# Altium schematic sheet RS485.SchDoc
size A4
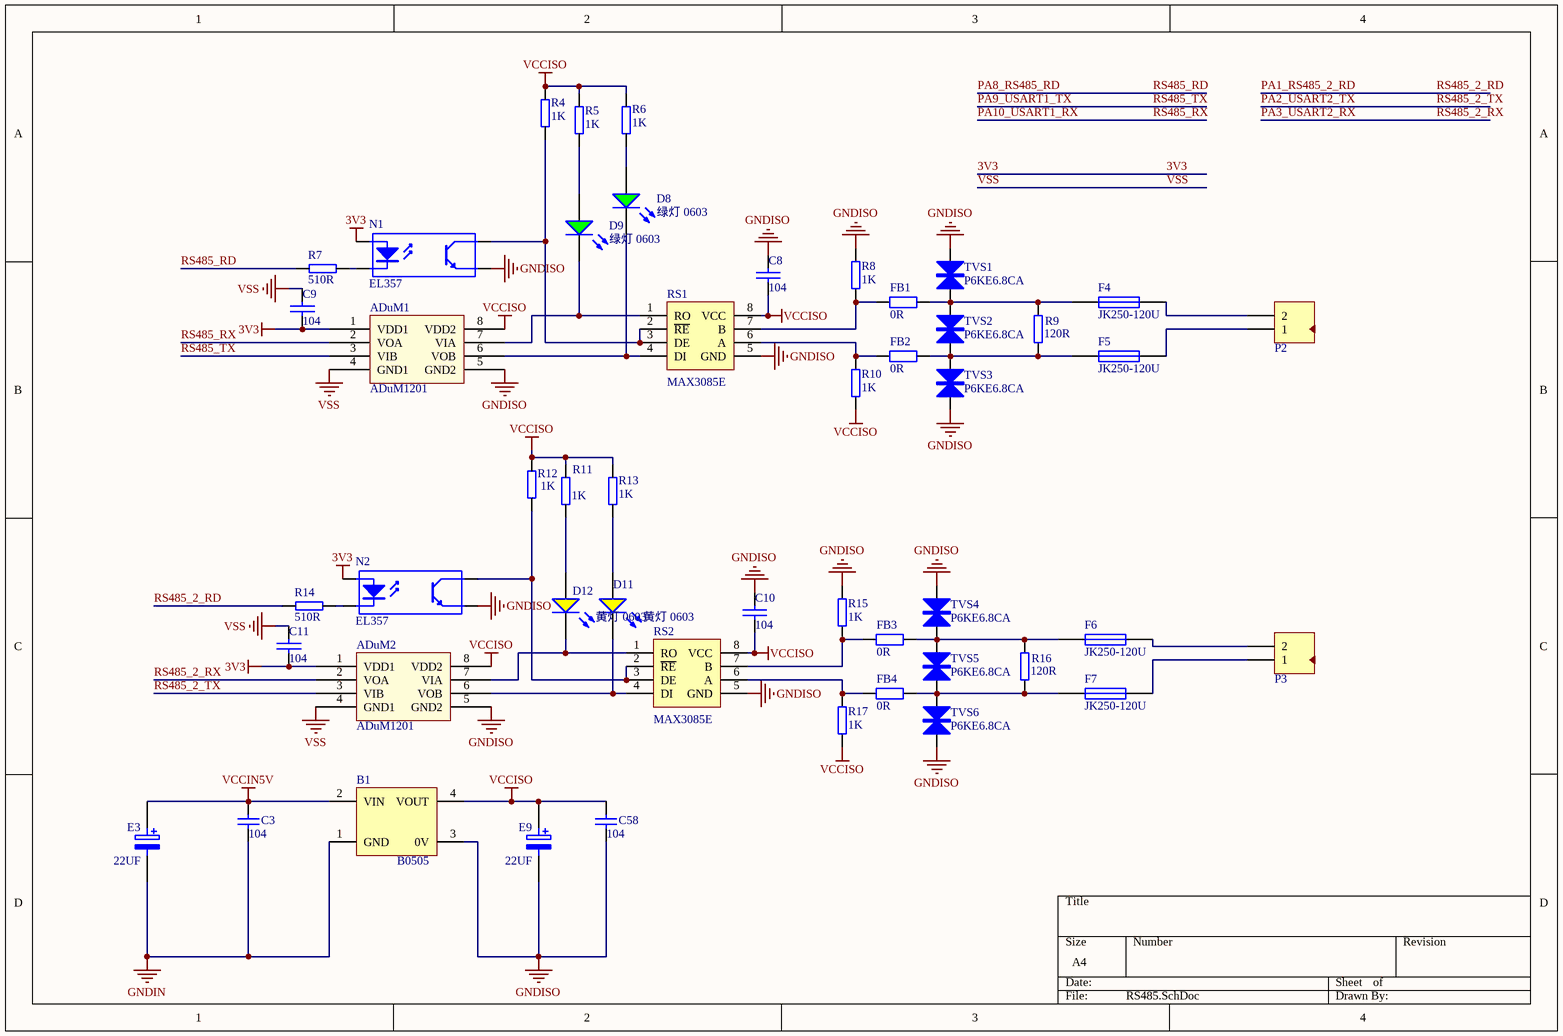
[diagram p0: RS485.SchDoc]

## Parts
ADuM1  ADuM1201  [SOIC-8]
ADuM2  ADuM1201  [SOIC-8]
B1  B0505  [B0505D-1WR2]
C3  104  [LC-0603_C]
C8  104  [LC-0603_C]
C9  104  [LC-0603_C]
C10  104  [LC-0603_C]
C11  104  [LC-0603_C]
C58  104  [LC-0603_C]
D8  绿灯 0603  [LC-0603_LED_S1]
D9  绿灯 0603  [LC-0603_LED_S1]
D11  黄灯 0603  [LC-0603_LED_S1]
D12  黄灯 0603  [LC-0603_LED_S1]
E3  22UF  [LC-CASE-B_3528]
E9  22UF  [LC-CASE-B_3528]
F4  JK250-120U  [ntc250v]
F5  JK250-120U  [ntc250v]
F6  JK250-120U  [ntc250v]
F7  JK250-120U  [ntc250v]
FB1  0R  [LC-0603_L]
FB2  0R  [LC-0603_L]
FB3  0R  [LC-0603_L]
FB4  0R  [LC-0603_L]
N1  EL357  [lc-sop-4_P2.54]
N2  EL357  [lc-sop-4_P2.54]
P2  Header 2  [D5.08-2P]  (value not drawn)
P3  Header 2  [D5.08-2P]  (value not drawn)
R4  1K  [LC-0603_R]
R5  1K  [LC-0603_R]
R6  1K  [LC-0603_R]
R7  510R  [LC-0603_R]
R8  1K  [LC-0603_R]
R9  120R  [LC-0603_R]
R10  1K  [LC-0603_R]
R11  1K  [LC-0603_R]
R12  1K  [LC-0603_R]
R13  1K  [LC-0603_R]
R14  510R  [LC-0603_R]
R15  1K  [LC-0603_R]
R16  120R  [LC-0603_R]
R17  1K  [LC-0603_R]
RS1  MAX3085E  [SOIC-8]
RS2  MAX3085E  [SOIC-8]
TVS1  P6KE6.8CA  [TVS]
TVS2  P6KE6.8CA  [TVS]
TVS3  P6KE6.8CA  [TVS]
TVS4  P6KE6.8CA  [TVS]
TVS5  P6KE6.8CA  [TVS]
TVS6  P6KE6.8CA  [TVS]

## Nets
3V3: ADuM1.1(VDD1) ADuM2.1(VDD1) C9.2 C11.2 N1.1(A) N2.1(A)
GNDIN: B1.1(GND) C3.2 E3.2
GNDISO: ADuM1.5(GND2) ADuM2.5(GND2) B1.3(0V) C8.1 C10.1 C58.2 E9.2 N1.3(E) N2.3(E) R8.1 R15.1 RS1.5(GND) RS2.5(GND) TVS1.2 TVS3.1 TVS4.2 TVS6.1
VCCIN5V: B1.2(VIN) C3.1 E3.1
VCCISO: ADuM1.8(VDD2) ADuM2.8(VDD2) B1.4(VOUT) C8.2 C10.2 C58.1 E9.1 R4.1 R5.2 R6.1 R10.2 R11.2 R12.1 R13.1 R17.2 RS1.8(VCC) RS2.8(VCC)
VSS: ADuM1.4(GND1) ADuM2.4(GND1) C9.1 C11.1
PA1_RS485_2_RD: R14.1  [also labelled RS485_2_RD]
PA2_USART2_TX: ADuM2.3(VIB)  [also labelled RS485_2_TX]
PA3_USART2_RX: ADuM2.2(VOA)  [also labelled RS485_2_RX]
PA8_RS485_RD: R7.1  [also labelled RS485_RD]
PA9_USART1_TX: ADuM1.3(VIB)  [also labelled RS485_TX]
PA10_USART1_RX: ADuM1.2(VOA)  [also labelled RS485_RX]
NetADuM1_6: ADuM1.6(VOB) D8.K RS1.4(DI)
NetADuM1_7: ADuM1.7(VIA) D9.K RS1.1(RO)
NetADuM2_6: ADuM2.6(VOB) D11.K RS2.4(DI)
NetADuM2_7: ADuM2.7(VIA) D12.K RS2.1(RO)
NetD8_A: D8.A R6.2
NetD9_A: D9.A R5.1
NetD11_A: D11.A R13.2
NetD12_A: D12.A R11.1
NetF4_1: F4.1 FB1.1 R9.2 TVS1.1 TVS2.2
NetF4_2: F4.2 P2.2
NetF5_1: F5.1 FB2.1 R9.1 TVS2.1 TVS3.2
NetF5_2: F5.2 P2.1
NetF6_1: F6.1 FB3.1 R16.2 TVS4.1 TVS5.2
NetF6_2: F6.2 P3.2
NetF7_1: F7.1 FB4.1 R16.1 TVS5.1 TVS6.2
NetF7_2: F7.2 P3.1
NetFB1_2: FB1.2 R8.2 RS1.7(B)
NetFB2_2: FB2.2 R10.1 RS1.6(A)
NetFB3_2: FB3.2 R15.2 RS2.7(B)
NetFB4_2: FB4.2 R17.1 RS2.6(A)
NetN1_2: N1.2(K) R7.2
NetN1_4: N1.4(C) R4.2 RS1.2(~{RE}) RS1.3(DE)
NetN2_2: N2.2(K) R14.2
NetN2_4: N2.4(C) R12.2 RS2.2(~{RE}) RS2.3(DE)

## Library data of the parts
C3 C58 = Cap: Capacitor; Value: 100nF; Published: 8-Jun-2000; Revision: July-2002: Re-released for DXP Platform.; Publisher: Altium Limited
C8-C11 = CAP
D8 D9 D11 D12 = 0: 发光二极管; ComponentLink1Descrip: 供应商链接; Package: 0603; Supplier: LC
  D8 D9: ComponentLink1URL: http://www.szlcsc.com/product/details_73152.html; SuppliersPartNumber: C72043
  D11 D12: ComponentLink1URL: http://www.szlcsc.com/product/details_73147.html; SuppliersPartNumber: C72038
E3 E9 = ELECTRO2: Electrolytic Capacitor
F4-F7 = F: 保险丝; Value: 1A
FB1-FB4 = Res2: Resistor; Published: 8-Jun-2000; LatestRevisionDate: 17-Jul-2002; LatestRevisionNote: Re-released for DXP Platform.; PackageReference: AXIAL-0.4; Publisher: Altium Limited; Value: 0R
N1 N2 = ST188: 反射式光电传感器; Published: 24-Mar-1999; LatestRevisionDate: 04-Mar-2005; LatestRevisionNote: Sch pins 3 & 4 Swapped.; DatasheetDocument: Nov-2003; PackageReference: DIP-4; Publisher: Altium Limited
P2 P3 = He: 接插件; LatestRevisionDate: 17-Jul-2002; LatestRevisionNote: Re-released for DXP Platform.; Publisher: Altium Limited
R4-R7 R11-R14 = RES2
R8-R10 R15-R17 = RES
TVS1-TVS6 = TVS